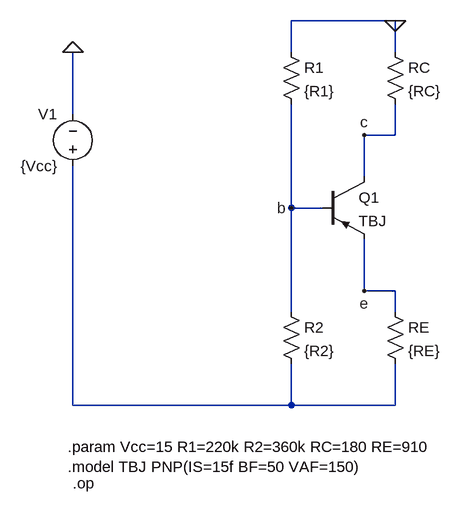
[diagram p0: schematic Q04 - Questão 5.asc]
Q04 - Questão 5.asc, the LTspice schematic file:
Version 4
SHEET 1 880 680
WIRE 288 -128 128 -128
WIRE 128 -80 128 -128
WIRE 288 -80 288 -128
WIRE -208 16 -208 -80
WIRE 288 48 288 0
WIRE 288 48 240 48
WIRE 240 112 240 48
WIRE 128 160 128 0
WIRE 176 160 128 160
WIRE 240 288 240 208
WIRE 288 288 240 288
WIRE 128 320 128 160
WIRE 288 320 288 288
WIRE -208 464 -208 96
WIRE 128 464 128 400
WIRE 128 464 -208 464
WIRE 288 464 288 400
WIRE 288 464 128 464
FLAG 288 -128 0
FLAG -208 -80 0
FLAG 240 288 e
FLAG 240 48 c
FLAG 128 160 b
SYMBOL pnp 176 112 R0
SYMATTR InstName Q1
SYMATTR Value TBJ
SYMBOL res 112 -96 R0
SYMATTR InstName R1
SYMATTR Value {R1}
SYMBOL res 272 -96 R0
SYMATTR InstName RC
SYMATTR Value {RC}
SYMBOL res 112 304 R0
SYMATTR InstName R2
SYMATTR Value {R2}
SYMBOL res 272 304 R0
SYMATTR InstName RE
SYMATTR Value {RE}
SYMBOL voltage -208 112 R180
WINDOW 0 24 96 Left 2
WINDOW 3 24 16 Left 2
SYMATTR InstName V1
SYMATTR Value {Vcc}
TEXT -216 528 Left 2 !.param Vcc=15 R1=220k R2=360k RC=180 RE=910\n.model TBJ PNP(IS=15f BF=50 VAF=150)
TEXT -208 584 Left 2 !.op

The netlist it stands for:
* Q04 - Questão 5.asc
Q1 c b e 0 TBJ
R1 0 b {R1}
RC 0 c {RC}
R2 b N001 {R2}
RE e N001 {RE}
V1 N001 0 {Vcc}
.model NPN NPN
.model PNP PNP
.lib standard.bjt
.param Vcc=15 R1=220k R2=360k RC=180 RE=910
.model TBJ PNP(IS=15f BF=50 VAF=150)
.op
.backanno
.end